# Altium project T20_DevBoard.PrjPcb (part 2 of 4)

## Sheet FTDI_USB.SchDoc: FTDI_USB
size 420 x 297 mm; DrawnBy: Orhun Dabak; Revision: 1.0; SheetNumber: 2; SheetTotal: 7; SPICEModelCacheUDHWENGR: <root> / <DocumentId>UDHWENGR</DocumentId> / <CacheFrame Number="0"> / <Model Name="emk105b7104_v-f" Kind="CKT"> / <Text>* EMK105B7104_V-F     SPICE MODEL  ( General Type ) / *-------------------------------------------------------------------------------------------------------- / * Model Generated by TAIYO YUDEN Corporation (http://www.ty-top.com) / * Version 1.0 / * TAIYO YUDEN Control No. 170508_060911 / * Copyright(c) 2012 TAIYO YUDEN CO.,LTD. All Rights Reserved. / *-------------------------------------------------------------------------------------------------------- / * / * Products Name : Multilayer Ceramic Capacitors / * / * Characteristics : / *     Capacitance : 0.1 uF , Rated Voltage : 16V , TCC : X7R / *     Case Size : 1.0 x 0.5 / 0.039 x 0.02 [mm/inch] , Thickness : 0.5 / 0.02 [mm/inch] / *     (Conditions: Temperature = 25 degC , DC Bias Current/Voltage = 0A / 0V) / * / * Frequency Range : 40Hz - 3GHz / * / * External Node Assignments : / * / *  1  o---| |---o  2 / * / *-------------------------------------------------------------------------------------------------------- / .SubCkt EMK105B7104_V-F 1 2 / **************************** / C0 1 110 0.078576u / Cm 1 101 9325p / C1 101 102 0.029504u / Rc1 101 102 20.922k / C2 102 103 0.015889u / Rc2 102 103 752.47 / C3 103 110 9030.9p / Rc3 103 110 42.225 / C2m 1 301 0.010371u / C21 301 302 0.22482u / Rc21 301 302 25.719k / C22 302 303 0.052111u / Rc22 302 303 73.689k / C23 303 304 0.075487u / Rc23 303 304 43.787k / C24 304 305 0.050427u / Rc24 304 305 2.2584k / C25 305 306 0.042135u / Rc25 305 306 2.2366k / C26 306 307 0.027488u / Rc26 306 307 1.4601k / C27 307 308 8717.3p / Rc27 307 308 231.75 / C28 308 309 8175.5p / Rc28 308 309 113.05 / C29 309 110 178.6p / Rc29 309 110 45.492 / Rp0 1 110 5G / L0 110 120 0.26393n / Lm 120 130 0.11117n / L1 120 121 0.031719n / RL1 121 130 1.0875 / L2 120 122 0.047268n / RL2 122 130 1.8421 / L3 120 123 0.48038n / RL3 123 130 1.1837 / CR 120 124 0.025618u / LR 124 125 0.058788n / RR 125 130 0.11414 / CL 130 140 2.3422p / LL 130 140 0.14249n / RL 130 140 315.53 / Rs 140 2 14.357m / **************************** / .ends EMK105B7104_V-F</Text> / </Model> / </CacheFrame> / </root>
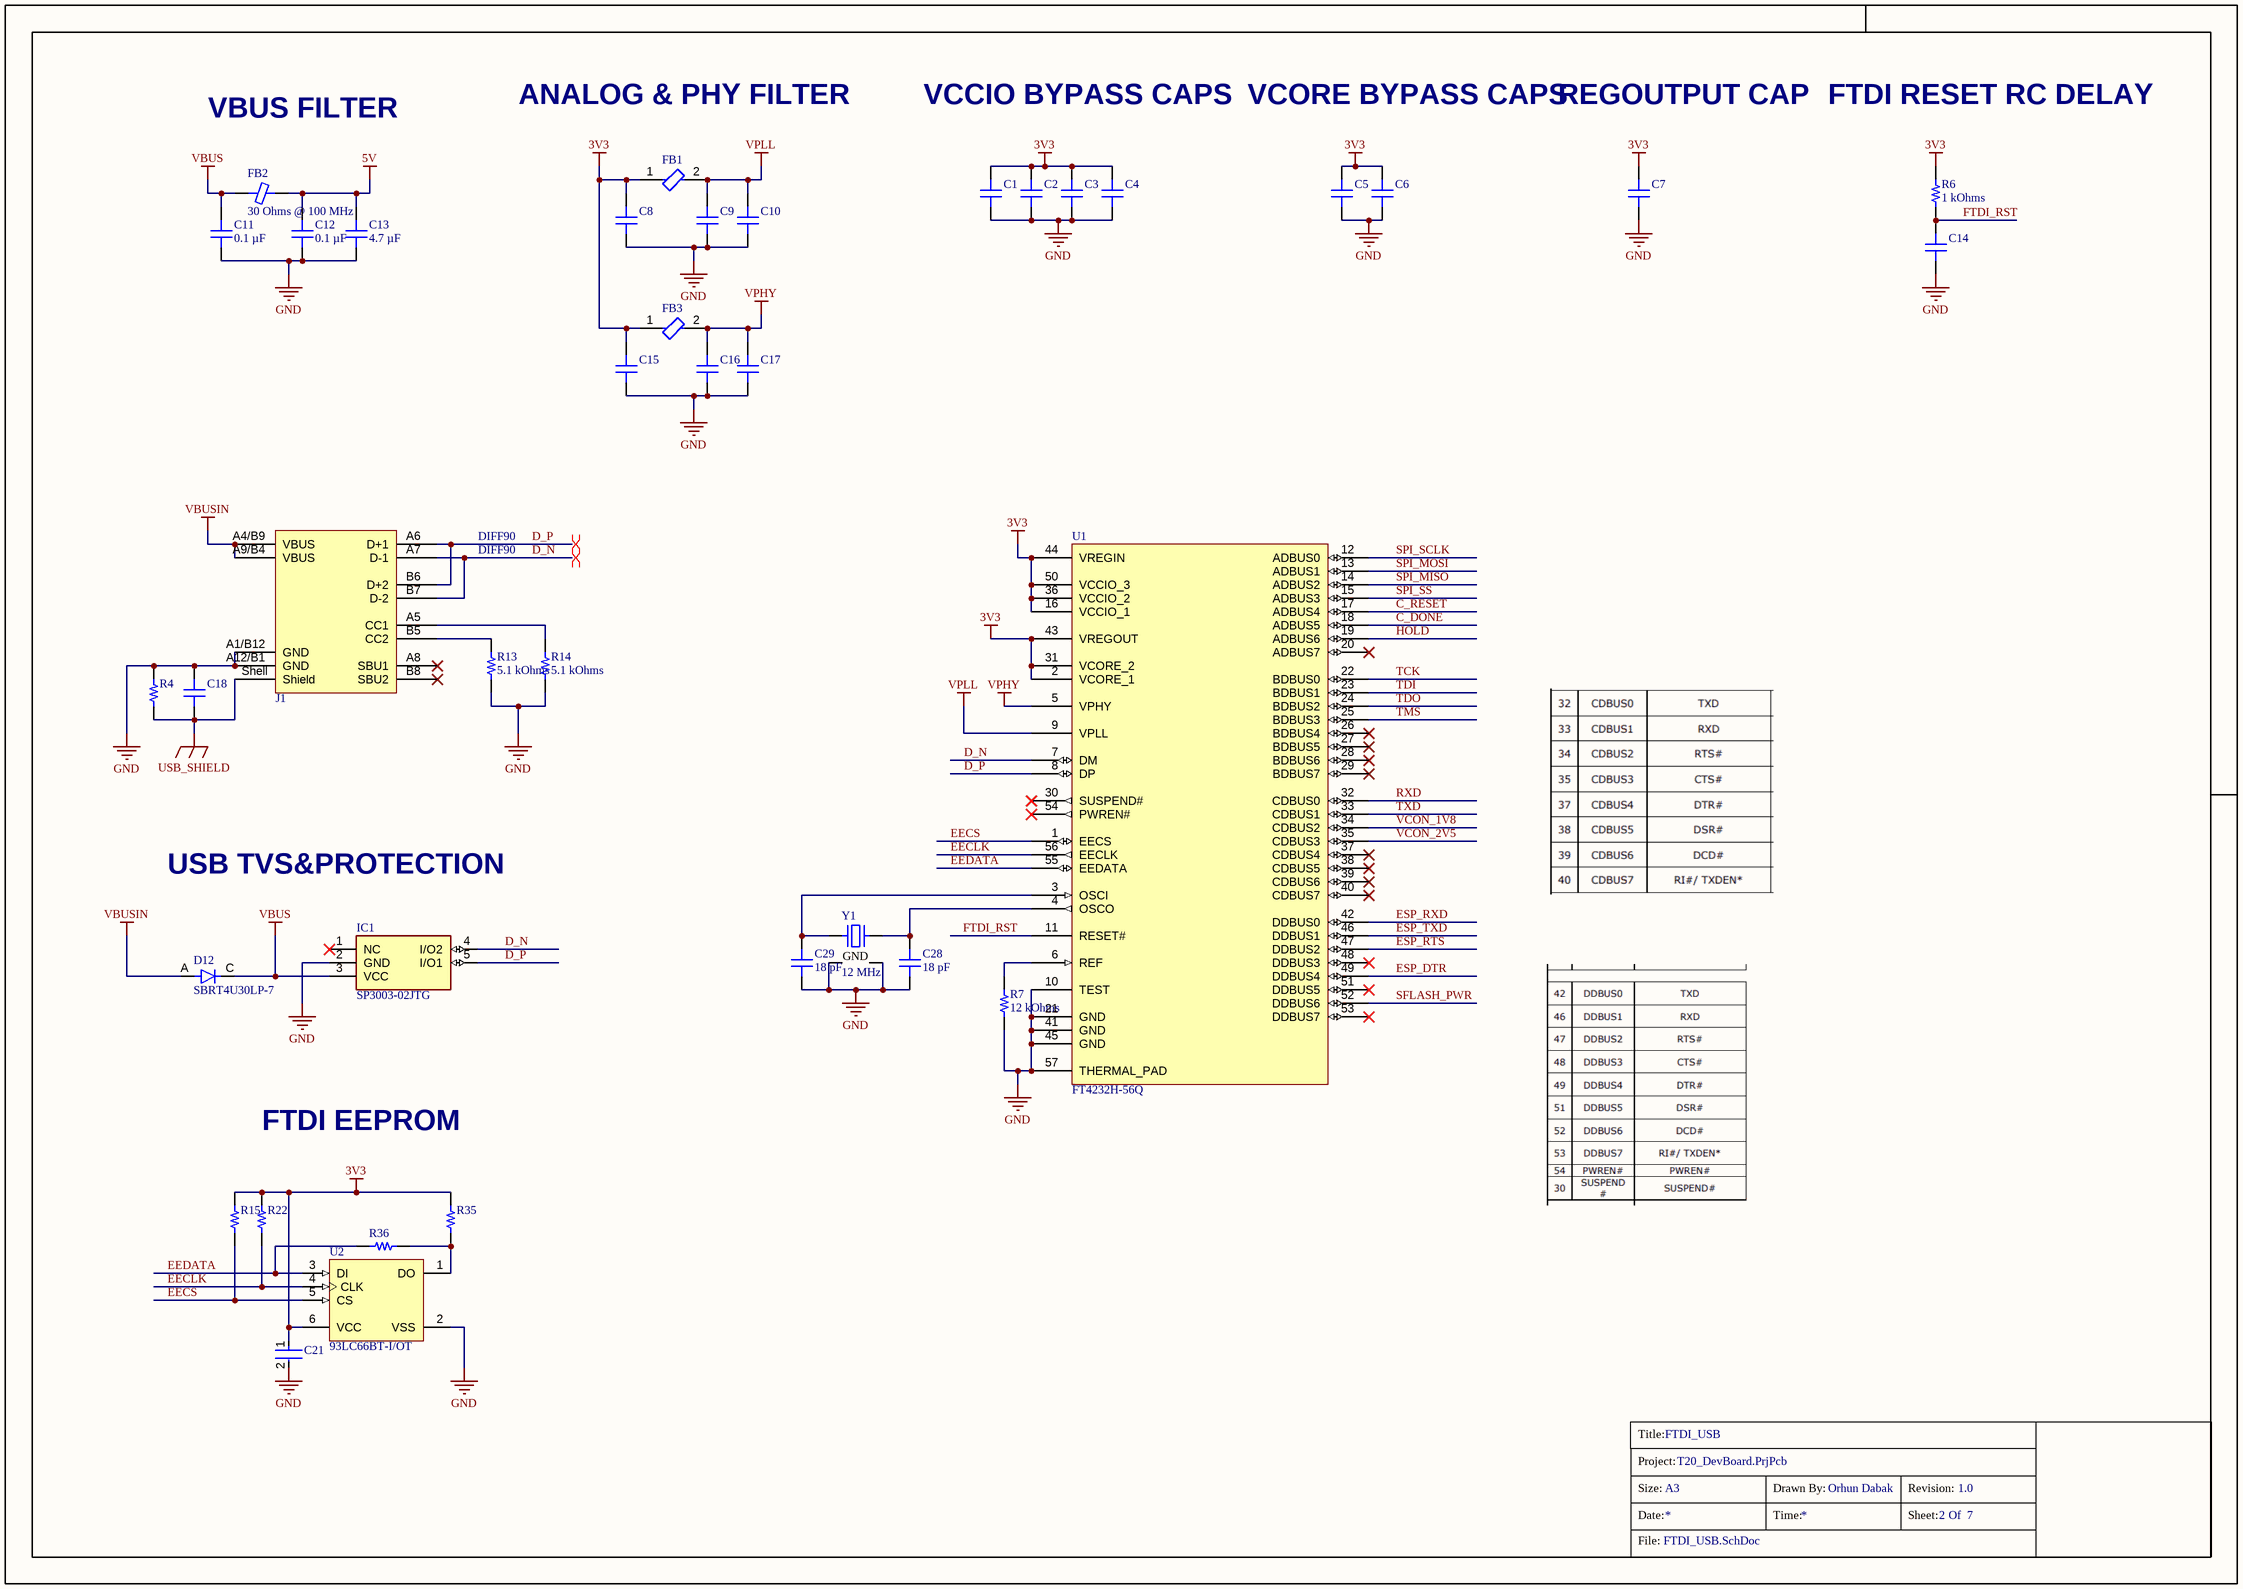
[diagram p1: FTDI_USB.SchDoc]

### Parts
(Parts that share a designator on the sheet are numbered #1, #2 ... from top to bottom, then left to right.)
?#2  (no value)  (graphical)
C1  0.1 µF  [CAP 0402_1005]  (value not drawn)
C2  0.1 µF  [CAP 0402_1005]  (value not drawn)
C3  0.1 µF  [CAP 0402_1005]  (value not drawn)
C4  0.1 µF  [CAP 0402_1005]  (value not drawn)
C5  0.1 µF  [CAP 0402_1005]  (value not drawn)
C6  0.1 µF  [CAP 0402_1005]  (value not drawn)
C7  4.7 µF  [CAP 0402_1005]  (value not drawn)
C8  0.1 µF  [CAP 0402_1005]  (value not drawn)
C9  0.1 µF  [CAP 0402_1005]  (value not drawn)
C10  4.7 µF  [CAP 0402_1005]  (value not drawn)
C11  0.1 µF  [CAP 0603_1608]
C12  0.1 µF  [CAP 0603_1608]
C13  4.7 µF  [CAP 0603_1608]
C14  0.1 µF  [CAP 0402_1005]  (value not drawn)
C15  0.1 µF  [CAP 0402_1005]  (value not drawn)
C16  0.1 µF  [CAP 0402_1005]  (value not drawn)
C17  4.7 µF  [CAP 0402_1005]  (value not drawn)
C18  10000 pF  [CAP 0402_1005]  (value not drawn)
C21  EMK105B7104KV-F  [FP-0402-L_1_0_0_05-W_0_5-MFG]  (value not drawn)
C28  18 pF  [CAP 0402_1005]
C29  18 pF  [CAP 0402_1005]
D12  SBRT4U30LP-7  [DIO_SBRT4U30LP-7]
FB1  BLM15AX601SN1D  [FP-BLM15-0_05-IPC_B]  (value not drawn)
FB2  30 Ohms @ 100 MHz  [FER 0805_2012]
FB3  BLM15AX601SN1D  [FP-BLM15-0_05-IPC_B]  (value not drawn)
IC1  SP3003-02JTG  [SOT65P220X110-5N]
J1  629722000214  [629722000214]  (value not drawn)
R4  1 MOhms  [RES 0402_1005]  (value not drawn)
R6  1 kOhms  [RES 0402_1005]
R7  12 kOhms  [RES 0402_1005]
R13  5.1 kOhms  [RES 0402_1005]
R14  5.1 kOhms  [RES 0402_1005]
R15  10 kOhms  [RES 0402_1005]  (value not drawn)
R22  10 kOhms  [RES 0402_1005]  (value not drawn)
R35  10 kOhms  [RES 0402_1005]  (value not drawn)
R36  2.2 kOhms  [RES 0402_1005]  (value not drawn)
U1  FT4232H-56Q  [QFN50P800X800X100-57N-D]
U2  93LC66BT-I/OT  [SOT-23-OT6_N]
Y1  12 MHz  [NDK NX3225GA]

### Nets
3V3: C1.2 C2.2 C3.2 C4.2 C5.2 C6.2 C7.2 C8.2 C15.2 C21.1 FB1.1 FB3.1 R6.2 R15.2 R22.2 R35.2 U1.2(VCORE_1) U1.16(VCCIO_1) U1.31(VCORE_2) U1.36(VCCIO_2) U1.43(VREGOUT) U1.44(VREGIN) U1.50(VCCIO_3) U2.6(VCC)
5V: C12.2 C13.2 FB2.2
GND: C1.1 C2.1 C3.1 C4.1 C5.1 C6.1 C7.1 C8.1 C9.1 C10.1 C11.1 C12.1 C13.1 C14.1 C15.1 C16.1 C17.1 C18.2 C21.2 C28.1 C29.1 IC1.2(GND) J1.A1/B12(GND) J1.A12/B1(GND) R4.2 R7.1 R13.1 R14.1 U1.10(TEST) U1.21(GND) U1.41(GND) U1.45(GND) U1.57(THERMAL_PAD) U2.2(VSS) Y1.2(GND) Y1.4(GND)
USB_SHIELD: C18.1 J1.Shell(Shield) R4.1
VBUS: C11.2 D12.C(K) FB2.1 IC1.3(VCC)
VBUSIN: D12.A J1.A4/B9(VBUS) J1.A9/B4(VBUS)
VPHY: C16.2 C17.2 FB3.2 U1.5(VPHY)
VPLL: C9.2 C10.2 FB1.2 U1.9(VPLL)
C_DONE: U1.18(ADBUS5)
C_RESET: U1.17(ADBUS4)
D_N: IC1.4(I/O2) J1.A7(D-1) J1.B7(D-2) U1.7(DM)
D_P: IC1.5(I/O1) J1.A6(D+1) J1.B6(D+2) U1.8(DP)
EECLK: R22.1 U1.56(EECLK) U2.4(CLK)
EECS: R15.1 U1.1(EECS) U2.5(CS)
EEDATA: R36.1 U1.55(EEDATA) U2.3(DI)
ESP_DTR: U1.49(DDBUS4)
ESP_RTS: U1.47(DDBUS2)
ESP_RXD: U1.42(DDBUS0)
ESP_TXD: U1.46(DDBUS1)
FTDI_RST: C14.2 R6.1 U1.11(RESET#)
HOLD: U1.19(ADBUS6)
RXD: U1.32(CDBUS0)
SFLASH_PWR: U1.52(DDBUS6)
SPI_MISO: U1.14(ADBUS2)
SPI_MOSI: U1.13(ADBUS1)
SPI_SCLK: U1.12(ADBUS0)
SPI_SS: U1.15(ADBUS3)
TCK: U1.22(BDBUS0)
TDI: U1.23(BDBUS1)
TDO: U1.24(BDBUS2)
TMS: U1.25(BDBUS3)
TXD: U1.33(CDBUS1)
VCON_1V8: U1.34(CDBUS2)
VCON_2V5: U1.35(CDBUS3)
NetC28_2: C28.2 U1.4(OSCO) Y1.3
NetC29_2: C29.2 U1.3(OSCI) Y1.1
NetJ1_A5: J1.A5(CC1) R14.2
NetJ1_B5: J1.B5(CC2) R13.2
NetR7_2: R7.2 U1.6(REF)
NetR35_1: R35.1 R36.2 U2.1(DO)

Not connected (* = marked no-connect by the designer): IC1 1(NC)*; J1 A8(SBU1)* B8(SBU2)*; U1 20(ADBUS7)* 26(BDBUS4)* 27(BDBUS5)* 28(BDBUS6)* 29(BDBUS7)* 30(SUSPEND#)* 37(CDBUS4)* 38(CDBUS5)* 39(CDBUS6)* 40(CDBUS7)* 48(DDBUS3)* 51(DDBUS5)* 53(DDBUS7)* 54(PWREN#)*

### Layout directives
differential pair; differential pair class DIFF90: D_N, D_P

### Notes on the sheet
- VBUS FILTER
- ANALOG & PHY FILTER
- VCCIO BYPASS CAPS
- VCORE BYPASS CAPS
- REGOUTPUT CAP
- FTDI RESET RC DELAY
- USB TVS&PROTECTION
- FTDI EEPROM
- Title:
- Project:
- Size:
- Date:
- File:
- A3
- Time:
- Drawn By:
- Sheet:
- Revision:
- Of

### Library data of the parts
?#2 = Title_Block
C1-C6 C8 C9 C14-C16 = CC0402KRX7R6BB104: CAP CER 0.1UF 10V X7R 0402; manufacturer: Yageo; Tolerance: ±10%; Part Number: CC0402KRX7R6BB104; Value: 0.1 µF; Applications: General Purpose; Capacitance: 0.1 µF; componentlink1description: Datasheet; componentlink1url: https://www.yageo.com/upload/media/product/productsearch/datasheet/mlcc/UPY-GPHC_X7R_6.3V-to-50V_18.pdf; componentlink2description: DigiKey Link; componentlink2url: https://www.digikey.com/en/products/detail/yageo/CC0402KRX7R6BB104/2103083; Device Package: 0402 (1005 Metric); lastupdated: 19/09/2022 12:57:28; Lifecycle Status: Active; Minimum Order: 1; Mounting Type: Surface Mount, MLCC; Operating Temperature: -55°C ~ 125°C; Package / Case: 0402 (1005 Metric); packaging: CutTape; partid: 3877; Part Status: Active; price: 0.01; series: CC; Size / Dimension: 0.039" L x 0.020" W (1.00mm x 0.50mm); Supplier 1: DigiKey; Supplier Part Number 1: 311-1345-1-ND; Temperature Coefficient: X7R; Thickness (Max): 0.022" (0.55mm); Voltage - Rated: 10V
C7 C10 C17 = CL05A475MP5NRNC: CAP CER 4.7UF 10V X5R 0402; manufacturer: Samsung Electro-Mechanics; Tolerance: ±20%; Part Number: CL05A475MP5NRNC; Value: 4.7 µF; Applications: General Purpose; Capacitance: 4.7 µF; componentlink1description: Datasheet; componentlink1url: http://www.samsungsem.com/kr/support/product-search/mlcc/CL05A475MP5NRNC.jsp; componentlink2description: DigiKey Link; componentlink2url: https://www.digikey.com/en/products/detail/samsung-electro-mechanics/CL05A475MP5NRNC/3887140; Device Package: 0402 (1005 Metric); lastupdated: 19/09/2022 12:57:17; Lifecycle Status: Active; Minimum Order: 1; Mounting Type: Surface Mount, MLCC; Operating Temperature: -55°C ~ 85°C; Package / Case: 0402 (1005 Metric); packaging: TapeAndReel; partid: 7650; Part Status: Active; price: 0.01; series: CL; Size / Dimension: 0.039" L x 0.020" W (1.00mm x 0.50mm); Supplier 1: DigiKey; Supplier Part Number 1: 1276-1482-1-ND; Temperature Coefficient: X5R; Thickness (Max): 0.022" (0.55mm); Voltage - Rated: 10V
C11 C12 = C0603X104M3RAC7867: CAP CER 0.1UF 25V X7R 0603; manufacturer: KEMET; Tolerance: ±20%; Part Number: C0603X104M3RAC7867; Value: 0.1 µF; Applications: Boardflex Sensitive; Capacitance: 0.1 µF; componentlink1description: Datasheet; componentlink1url: https://api.kemet.com/component-edge/download/datasheet/C0603X104M3RACTU.pdf; componentlink2description: DigiKey Link; componentlink2url: https://www.digikey.com/en/products/detail/kemet/C0603X104M3RAC7867/2202613; Device Package: 0603 (1608 Metric); Features: Soft Termination; lastupdated: 9/19/2022 01:01:19 PM; Lifecycle Status: Active; Minimum Order: 1; Mounting Type: Surface Mount, MLCC; Operating Temperature: -55°C ~ 125°C; Package / Case: 0603 (1608 Metric); packaging: TapeAndReel; partid: 2484; Part Status: Active; price: 0.07; series: SMD Comm X7R Flex; Size / Dimension: 0.063" L x 0.031" W (1.60mm x 0.80mm); Supplier 1: DigiKey; Supplier Part Number 1: 399-13148-1-ND; Temperature Coefficient: X7R; Thickness (Max): 0.034" (0.87mm); Voltage - Rated: 25V
C13 = CL10A475KA8NQNC: CAP CER 4.7UF 25V X5R 0603; manufacturer: Samsung Electro-Mechanics; Tolerance: ±10%; Part Number: CL10A475KA8NQNC; Value: 4.7 µF; Applications: General Purpose; Capacitance: 4.7 µF; componentlink1description: Datasheet; componentlink1url: http://www.samsungsem.com/kr/support/product-search/mlcc/CL10A475KA8NQNC.jsp; componentlink2description: DigiKey Link; componentlink2url: https://www.digikey.com/en/products/detail/samsung-electro-mechanics/CL10A475KA8NQNC/3887558; Device Package: 0603 (1608 Metric); lastupdated: 1/3/2023 08:07:48 PM; Lifecycle Status: Active; Minimum Order: 1; Mounting Type: Surface Mount, MLCC; Operating Temperature: -55°C ~ 85°C; Package / Case: 0603 (1608 Metric); packaging: TapeAndReel; partid: 2349; Part Status: Active; price: 0.06; series: CL; Size / Dimension: 0.063" L x 0.031" W (1.60mm x 0.80mm); Supplier 1: DigiKey; Supplier Part Number 1: 1276-1900-1-ND; Temperature Coefficient: X5R; Thickness (Max): 0.035" (0.90mm); Voltage - Rated: 25V
C18 = CC0402KRX7R0BB103: CAP CER 10000PF 100V X7R 0402; manufacturer: Yageo; Tolerance: ±10%; Part Number: CC0402KRX7R0BB103; Value: 10000 pF; Applications: General Purpose; Capacitance: 10000 pF; componentlink1description: Datasheet; componentlink1url: https://www.yageo.com/upload/media/product/productsearch/datasheet/mlcc/UPY-NP0X7R_MV_100-to-630V_24.pdf; componentlink2description: DigiKey Link; componentlink2url: https://www.digikey.com/en/products/detail/yageo/CC0402KRX7R0BB103/11489823; Device Package: 0402 (1005 Metric); lastupdated: 19/09/2022 12:56:51; Lifecycle Status: Active; Minimum Order: 1; Mounting Type: Surface Mount, MLCC; Operating Temperature: -55°C ~ 125°C; Package / Case: 0402 (1005 Metric); packaging: TapeAndReel; partid: 33421; Part Status: Active; price: 0.01; series: CC; Size / Dimension: 0.039" L x 0.020" W (1.00mm x 0.50mm); Supplier 1: DigiKey; Supplier Part Number 1: 13-CC0402KRX7R0BB103CT-ND; Temperature Coefficient: X7R; Thickness (Max): 0.022" (0.55mm); Voltage - Rated: 100V
C21 = CMP-14477-000055-2: None; Voltage Rating: 16V; Tolerance: 10%; Dielectric: X7R; Capacitance: 100nF; Width: 0.02inch; RoHS Compliant: Yes; Resistor Type: Ceramic; Radiation Hardening: No; Case Code (Imperial): 0402; Height: 0.5mm; Case Code (Metric): 1005; Halogen Free: Halogen Free; Series: M; Thickness: 0.022inch; Case/Package: 0402; Construction: Flat; Mount: Surface Mount; Voltage Rating (DC): 16V; Depth: 0.5mm; Min Operating Temperature: -55°C; Package Quantity: 1; Packaging: Tape and Reel; Termination: SMD/SMT; Length: 1mm; Max Operating Temperature: 125°C; Lead Free: Lead Free; Number of Pins: 2
C28 C29 = C0402C180J5GACAUTO: CAP CER 18PF 50V C0G/NP0 0402; manufacturer: KEMET; Temperature Coefficient: C0G, NP0; Tolerance: ±5%; Part Number: C0402C180J5GACAUTO; Value: 18 pF; Applications: Automotive; Capacitance: 18 pF; componentlink1description: Datasheet; componentlink1url: https://api.kemet.com/component-edge/download/datasheet/C0402C180J5GACAUTO.pdf; componentlink2description: DigiKey Link; componentlink2url: https://www.digikey.com/en/products/detail/kemet/C0402C180J5GACAUTO/7516186; Device Package: 0402 (1005 Metric); Features: Low ESL; lastupdated: 1/27/2023 08:04:30 PM; Lifecycle Status: Active; Minimum Order: 1; Mounting Type: Surface Mount, MLCC; Operating Temperature: -55°C ~ 125°C; Package / Case: 0402 (1005 Metric); packaging: TapeAndReel; partid: 1878; Part Status: Active; price: 0.01; Ratings: AEC-Q200; series: SMD Auto C0G; Size / Dimension: 0.039" L x 0.020" W (1.00mm x 0.50mm); Supplier 1: DigiKey; Supplier Part Number 1: 399-15952-1-ND; Thickness (Max): 0.022" (0.55mm); Voltage - Rated: 50V
D12 = SBRT4U30LP-7: Diode Super Barrier 30 V 4A Surface Mount U-DFN2020-2; MF: Diodes Inc.; Purchase-URL: https://pricing.snapeda.com/search/part/SBRT4U30LP-7/?ref=eda; Price: None; Value: *; Check_prices: https://www.snapeda.com/parts/SBRT4U30LP-7/Diodes+Inc./view-part/?ref=eda; SnapEDA_Link: https://www.snapeda.com/parts/SBRT4U30LP-7/Diodes+Inc./view-part/?ref=snap; Package: UFDFN-2 Diodes Inc.; Availability: In Stock; MP: SBRT4U30LP-7
FB1 FB3 = CMP-0686-00246-4: Chip Ferrite Bead, 0402, 600Ω @ 100MHz, 0.34Ω, 25%, 500mA; Material: Steel; DC Resistance (DCR): 340mR; Impedance: 600R; Number of Circuits: 1; Max Current Rating: 500mA; Core Material: Ferrite; Lead Free: Lead Free; Series: BLM15AX_SN; Number of Pins: 2; Package Quantity: 1; Length: 1mm; Height: 0.5mm; Width: 0.5mm; Packaging: Tape and Reel; RoHS Compliant: Yes; Test Frequency: 100MHz; Case Code (Imperial): 0402; Depth: 0.5mm; Case/Package: 0402; Min Operating Temperature: -55°C; Max Operating Temperature: 125°C; Max DC Current: 500mA; Current Rating: 500mA; REACH SVHC: No SVHC; Termination: SMD/SMT; Tolerance: 25%; Case Code (Metric): 1005; Number of Lines: 1; DC Resistance-Max: 340mR
FB2 = BLM21PG300SN1D: FERRITE BEAD 30 OHM 0805 1LN; Manufacturer: Murata Electronics; Current Rating (Max): 4A; DC Resistance (DCR) (Max): 14mOhm; Filter Type: Power Line; Number of Lines: 1; Part Number: BLM21PG300SN1D; ComponentLink1Description: Datasheet; ComponentLink1URL: https://www.murata.com/en-us/products/en-us/products/productdata/8796738977822/ENFA0005.pdf; ComponentLink2Description: DigiKey Link; ComponentLink2URL: https://www.digikey.com/en/products/detail/murata-electronics/BLM21PG300SN1D/584262; Device Package: 0805 (2012 Metric); Height (Max): 0.041" (1.05mm); Impedance @ Frequency: 30 Ohms @ 100 MHz; LastUpdated: 1/2/2023 08:51:58 PM; Lifecycle Status: Active; Minimum Order: 1; Mounting Type: Surface Mount; Operating Temperature: -55°C ~ 125°C; Package / Case: 0805 (2012 Metric); Packaging: TapeAndReel; PartId: 1376; Part Status: Active; Price: 0.02; Series: EMIFIL®, BLM21; Size / Dimension: 0.079" L x 0.049" W (2.00mm x 1.25mm); Supplier 1: DigiKey; Supplier Part Number 1: 490-1052-1-ND; Value: 30 Ohms @ 100 MHz
IC1 = SP3003-02JTG: Integrated Circuit; Manufacturer_Name: LITTELFUSE; Datasheet Link: https://datasheet.datasheetarchive.com/originals/distributors/Datasheets-DGA26/1840396.pdf; Height: 1.1mm; Manufacturer_Part_Number: SP3003-02JTG; Mouser Part Number: 576-SP3003-02JTG; Mouser Price/Stock: https://www.mouser.co.uk/ProductDetail/Littelfuse/SP3003-02JTG?qs=je4hkJKt%2FJ1VE%2FhJSW73jg%3D%3D; Arrow Part Number: SP3003-02JTG; Arrow Price/Stock: https://www.arrow.com/en/products/sp3003-02jtg/littelfuse?region=nac
J1 = 629722000214: WR-USB 2.0 Type C, Receptacle, Horizontal, SMT; Manufacturer: Wurth Elektronik; Interface Type: Type C; Number of Ports: 1; Rated Current: 5A; Working Voltage: 20VAC; ComponentLink1Description: Website Link; ComponentLink1URL: https://www.we-online.com/redexpert/article/629722000214?ad; ComponentLink2Description: Datasheet Link; ComponentLink2URL: https://www.we-online.com/redexpert/spec/629722000214?ad; Manufacturer Part Number: 629722000214; Category: Input/Output Connectors; Match Code: WR-USB; Mount: Surface Mount; Operating Temperature Max: 85°C; Operating Temperature Min: -40°C; Packaging: Tape and Reel; Application: USB 2.0; Gender: Receptacle; Number of Pins: 16; Orientation: Horizontal
R4 = AC0402FR-071ML: RES SMD 1M OHM 1% 1/16W 0402; Manufacturer: Yageo; Power (Watts): 0.063W, 1/16W; Temperature Coefficient: ±100ppm/°C; Part Number: AC0402FR-071ML; Value: 1 MOhms; ComponentLink1Description: Datasheet; ComponentLink1URL: https://www.yageo.com/upload/media/product/productsearch/datasheet/rchip/PYu-AC_51_RoHS_L_7.pdf; ComponentLink2Description: DigiKey Link; ComponentLink2URL: https://www.digikey.com/en/products/detail/yageo/AC0402FR-071ML/5895164; Composition: Thick Film; Device Package: 0402 (1005 Metric); Features: Automotive AEC-Q200, Moisture Resistant; Height - Seated (Max): 0.015" (0.37mm); LastUpdated: 19/09/2022 13:14:31; Lifecycle Status: Active; Minimum Order: 1; Number of Terminations: 2; Operating Temperature: -55°C ~ 155°C; Package / Case: 0402 (1005 Metric); Packaging: CutTape; PartId: 12043; Part Status: Active; Price: 0.01; Ratings: AEC-Q200; Resistance: 1 MOhms; Series: AC; Size / Dimension: 0.039" L x 0.020" W (1.00mm x 0.50mm); Supplier 1: DigiKey; Supplier Part Number 1: YAG3450CT-ND; Supplier Device Package: 0402; Tolerance: ±1%
R6 = RC0402JR-071KP: RES SMD 1K OHM 5% 1/16W 0402; Manufacturer: Yageo; Power (Watts): 0.063W, 1/16W; Temperature Coefficient: ±150ppm/°C; Part Number: RC0402JR-071KP; Value: 1 kOhms; ComponentLink1Description: Datasheet; ComponentLink1URL: http://www.yageo.com/NewPortal/yageodocoutput?fileName=/pdf/R-Chip/PYu-RC_51_RoHS_P_0.pdf; ComponentLink2Description: DigiKey Link; ComponentLink2URL: https://www.digikey.com/en/products/detail/yageo/RC0402JR-071KP/4935299; Composition: Thick Film; Device Package: 0402 (1005 Metric); Features: Moisture Resistant; Height - Seated (Max): 0.016" (0.40mm); LastUpdated: 1/2/2023 08:21:40 PM; Lifecycle Status: Active; Minimum Order: 1; Number of Terminations: 2; Operating Temperature: -55°C ~ 155°C; Package / Case: 0402 (1005 Metric); Packaging: CutTape; PartId: 5283; Part Status: Active; Price: 0.01; Resistance: 1 kOhms; Series: RC-P Lead Free; Size / Dimension: 0.039" L x 0.020" W (1.00mm x 0.50mm); Supplier 1: DigiKey; Supplier Part Number 1: YAG1284CT-ND; Supplier Device Package: 0402; Tolerance: ±5%
R7 = CPF0402B12KE1: RES SMD 12K OHM 0.1% 1/16W 0402; Manufacturer: TE Connectivity Passive Product; Power (Watts): 0.063W, 1/16W; Temperature Coefficient: ±25ppm/°C; Part Number: CPF0402B12KE1; Value: 12 kOhms; ComponentLink1Description: Datasheet; ComponentLink1URL: https://www.te.com/commerce/DocumentDelivery/DDEController?Action=srchrtrv&DocNm=1773200&DocType=DS&DocLang=English; ComponentLink2Description: DigiKey Link; ComponentLink2URL: https://www.digikey.com/en/products/detail/te-connectivity-passive-product/CPF0402B12KE1/2381830; Composition: Thin Film; Device Package: 0402 (1005 Metric); Height - Seated (Max): 0.014" (0.35mm); LastUpdated: 1/2/2023 08:21:48 PM; Lifecycle Status: Active; Minimum Order: 1; Number of Terminations: 2; Operating Temperature: -55°C ~ 155°C; Package / Case: 0402 (1005 Metric); Packaging: TapeAndReel; PartId: 3318; Part Status: Active; Price: 0.13; Resistance: 12 kOhms; Series: CPF, Neohm; Size / Dimension: 0.039" L x 0.020" W (1.00mm x 0.50mm); Supplier 1: DigiKey; Supplier Part Number 1: A102603CT-ND; Supplier Device Package: 0402; Tolerance: ±0.1%
R13 R14 = AC0402JR-075K1L: RES SMD 5.1K OHM 5% 1/16W 0402; Manufacturer: Yageo; Power (Watts): 0.063W, 1/16W; Temperature Coefficient: ±100ppm/°C; Part Number: AC0402JR-075K1L; Value: 5.1 kOhms; ComponentLink1Description: Datasheet; ComponentLink1URL: https://www.yageo.com/upload/media/product/productsearch/datasheet/rchip/PYu-AC_51_RoHS_L_7.pdf; ComponentLink2Description: DigiKey Link; ComponentLink2URL: https://www.digikey.com/en/products/detail/yageo/AC0402JR-075K1L/5895695; Composition: Thick Film; Device Package: 0402 (1005 Metric); Features: Automotive AEC-Q200, Moisture Resistant; Height - Seated (Max): 0.015" (0.37mm); LastUpdated: 1/2/2023 08:21:43 PM; Lifecycle Status: Active; Minimum Order: 1; Number of Terminations: 2; Operating Temperature: -55°C ~ 155°C; Package / Case: 0402 (1005 Metric); Packaging: CutTape; PartId: 4690; Part Status: Active; Price: 0.01; Ratings: AEC-Q200; Resistance: 5.1 kOhms; Series: AC; Size / Dimension: 0.039" L x 0.020" W (1.00mm x 0.50mm); Supplier 1: DigiKey; Supplier Part Number 1: YAG3554CT-ND; Supplier Device Package: 0402; Tolerance: ±5%
R15 R22 R35 = RP73PF1E10KBTD: RES 10K OHM 0.1% 1/10W 0402; Manufacturer: TE Connectivity Passive Product; Power (Watts): 0.1W, 1/10W; Temperature Coefficient: ±25ppm/°C; Part Number: RP73PF1E10KBTD; Value: 10 kOhms; ComponentLink1Description: Datasheet; ComponentLink1URL: https://www.te.com/commerce/DocumentDelivery/DDEController?Action=srchrtrv&DocNm=1773272&DocType=DS&DocLang=English; ComponentLink2Description: DigiKey Link; ComponentLink2URL: https://www.digikey.com/en/products/detail/te-connectivity-passive-product/RP73PF1E10KBTD/8260957; Composition: Thin Film; Device Package: 0402 (1005 Metric); Height - Seated (Max): 0.014" (0.35mm); LastUpdated: 9/19/2022 01:15:04 PM; Lifecycle Status: Active; Minimum Order: 1; Number of Terminations: 2; Operating Temperature: -55°C ~ 155°C; Package / Case: 0402 (1005 Metric); Packaging: TapeAndReel; PartId: 2434; Part Status: Active; Price: 0.09; Resistance: 10 kOhms; Series: RP73, Holsworthy; Size / Dimension: 0.039" L x 0.020" W (1.00mm x 0.50mm); Supplier 1: DigiKey; Supplier Part Number 1: A127415CT-ND; Supplier Device Package: 0402; Tolerance: ±0.1%
R36 = TNPW04022K20BYEP: RES 2.2K OHM 0.1% 1/10W 0402; Manufacturer: Vishay Dale; Power (Watts): 0.1W, 1/10W; Temperature Coefficient: ±10ppm/°C; Part Number: TNPW04022K20BYEP; Value: 2.2 kOhms; ComponentLink1Description: Datasheet; ComponentLink1URL: http://www.vishay.com/docs/28758/tnpw_e3.pdf; ComponentLink2Description: DigiKey Link; ComponentLink2URL: https://www.digikey.com/en/products/detail/vishay-dale/TNPW04022K20BYEP/8636618; Composition: Thin Film; Device Package: 0402 (1005 Metric); Features: Anti-Sulfur, Automotive AEC-Q200, Moisture Resistant; Height - Seated (Max): 0.016" (0.40mm); LastUpdated: 1/2/2023 08:21:49 PM; Lifecycle Status: Active; Minimum Order: 1; Number of Terminations: 2; Operating Temperature: -55°C ~ 155°C; Package / Case: 0402 (1005 Metric); Packaging: TapeAndReel; PartId: 3077; Part Status: Active; Price: 0.28; Ratings: AEC-Q200; Resistance: 2.2 kOhms; Series: TNPW e3; Size / Dimension: 0.039" L x 0.020" W (1.00mm x 0.50mm); Supplier 1: DigiKey; Supplier Part Number 1: 541-9805-1-ND; Supplier Device Package: 0402; Tolerance: ±0.1%
U1 = FT4232H-56Q: USB Bridge, USB to UART,FIFO USB 2.0 FIFO Interface 56-VQFN (8x8); Manufacturer: FTDI, Future Technology Devices International Ltd; Manufacturer Product Number: FT4232H-56Q-REEL; Standards: USB 2.0; Voltage - Supply: 3.3V; Supplier 1: Digi-Key; Supplier Part Number 1: 768-1378-1-ND; Supplier 2: Digi-Key; Supplier Part Number 2: 768-1378-6-ND; Supplier 3: RSComponents; Supplier Part Number 3: 1115836; Series: -; Protocol: USB; Function: Bridge, USB to UART,FIFO; Interface: FIFO; Current - Supply: -; ComponentLink1Description: Datasheet; ComponentLink1URL: https://www.ftdichip.com/Support/Documents/DataSheets/ICs/DS_FT4232H.pdf; ComponentLink2Description: Digi-Key Link; ComponentLink2URL: https://www.digikey.com/en/products/detail/ftdi-future-technology-devices-international-ltd/FT4232H-56Q-REEL/5994692; Operating Temperature: -40°C ~ 85°C; Package / Case: 56-VFQFN Exposed Pad; Supplier Device Package: 56-VQFN (8x8)
U2 = CMP-019-00051-3: Microwire Serial EEPROM Family, 2.5Vto 5.5V' 2 MHz, -40°Cto 125°C, SOT-23-6, RoHS
Y1 = NX3225GA-12MHZ-STD-CRG-2: CRYSTAL 12.0000MHZ 8PF SMD; Manufacturer: NDK America, Inc.; ESR (Equivalent Series Resistance): 100 Ohms; Frequency Stability: ±30ppm; Frequency Tolerance: ±20ppm; Operating Mode: Fundamental; Part Number: NX3225GA-12MHZ-STD-CRG-2; ComponentLink1Description: Datasheet; ComponentLink1URL: http://www.ndk.com/images/products/catalog/c_NX3225GA-STD-CRG-2_e.pdf; ComponentLink2Description: DigiKey Link; ComponentLink2URL: https://www.digikey.com/en/products/detail/ndk-america-inc/NX3225GA-12MHZ-STD-CRG-2/3125632; Frequency: 12 MHz; Height - Seated (Max): 0.035" (0.90mm); LastUpdated: 19/09/2022 13:51:54; Lifecycle Status: Active; Load Capacitance: 8pF; Minimum Order: 1; Mounting Type: Surface Mount; Operating Temperature: -40°C ~ 85°C; Package / Case: 4-SMD, No Lead; Packaging: TapeAndReel; PartId: 551; Part Status: Active; Price: 0.33; Series: NX3225GA; Size / Dimension: 0.126" L x 0.098" W (3.20mm x 2.50mm); Supplier 1: DigiKey; Supplier Part Number 1: 644-1173-1-ND; Type: MHz Crystal; Value: 12 MHz

## Sheet USB_OTG.SchDoc: USB_OTG
size 420 x 297 mm; DrawnBy: Orhun Dabak; Revision: 1.0; SheetNumber: 3; SheetTotal: 7; SPICEModelCacheBLVHRVRQ: <root> / <DocumentId>BLVHRVRQ</DocumentId> / </root>
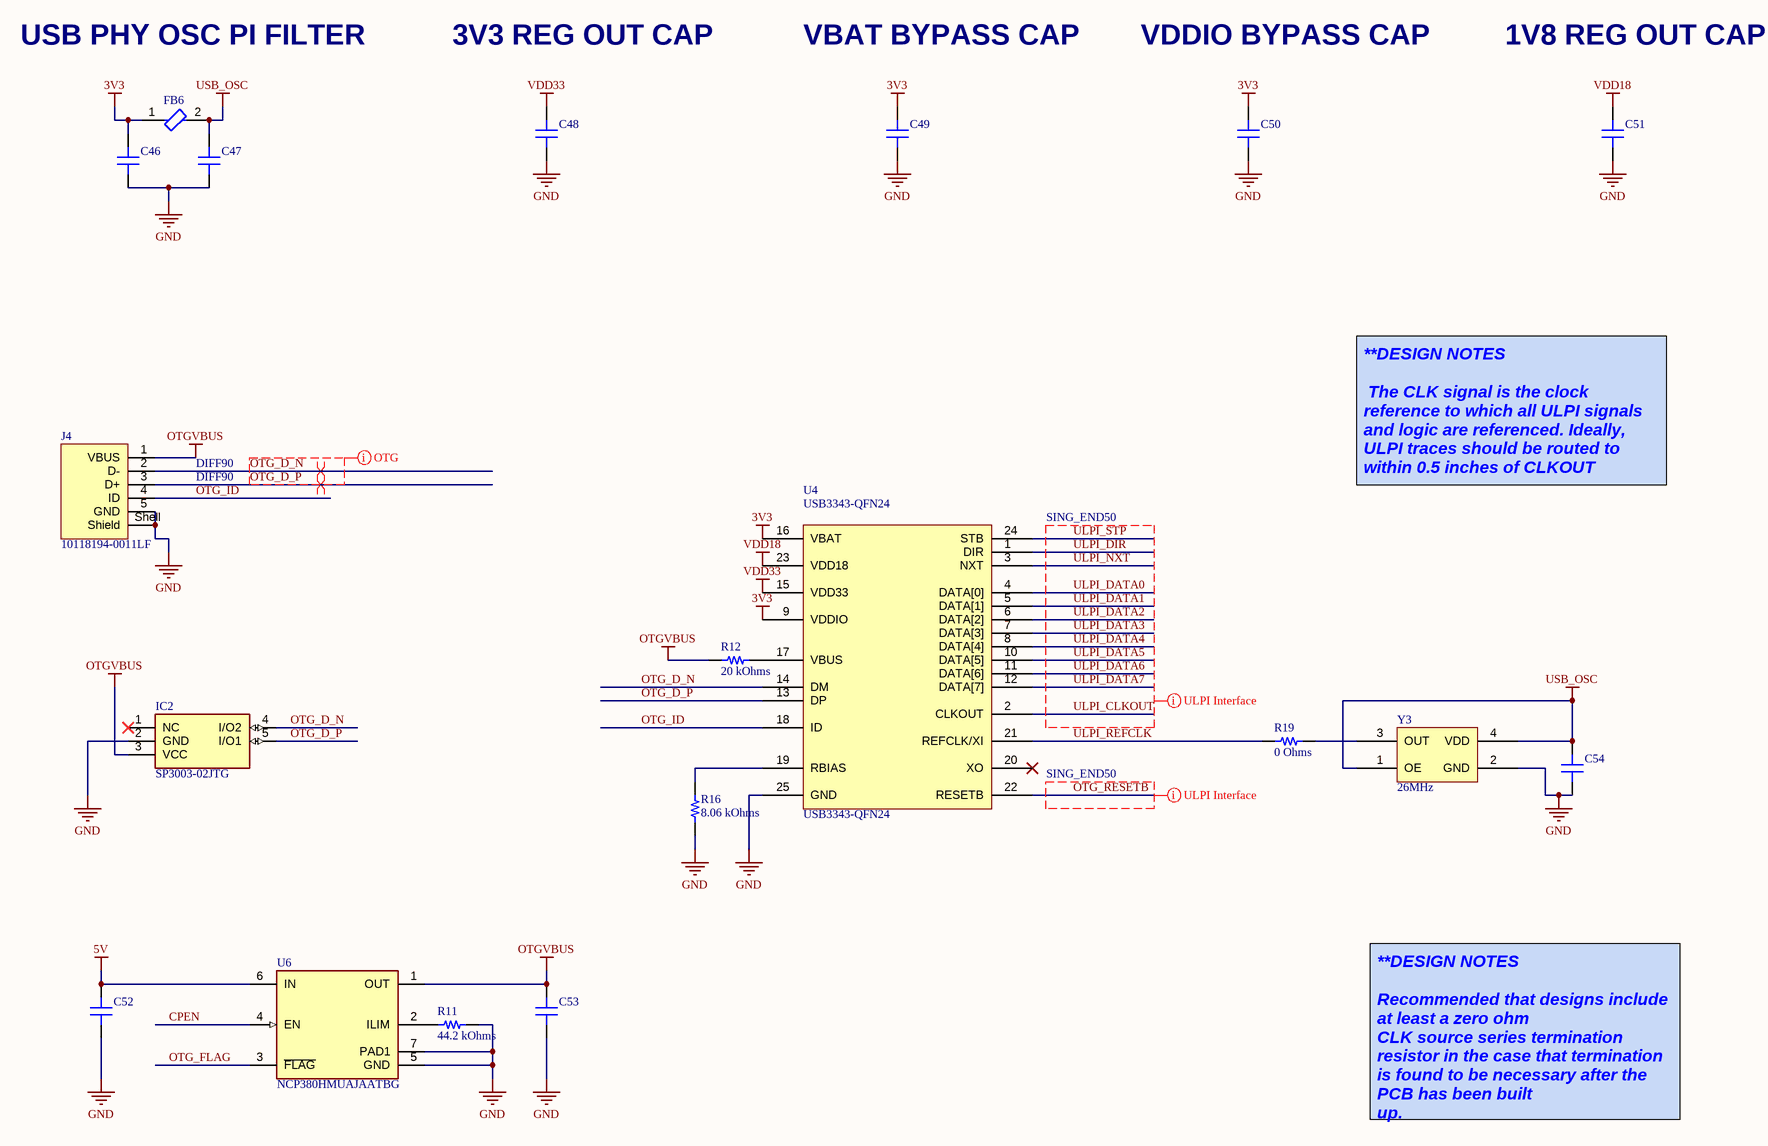
[diagram p2: USB_OTG.SchDoc]

### Parts
(Parts that share a designator on the sheet are numbered #1, #2 ... from top to bottom, then left to right.)
?#3  (no value)  (graphical)
C46  4.7 µF  [CAP 0402_1005]  (value not drawn)
C47  4.7 µF  [CAP 0402_1005]  (value not drawn)
C48  4.7µF  [CAP 0402_1005]  (value not drawn)
C49  0.1 µF  [CAP 0402_1005]  (value not drawn)
C50  0.1 µF  [CAP 0402_1005]  (value not drawn)
C51  4.7µF  [CAP 0402_1005]  (value not drawn)
C52  10 µF  [CAP 0402_1005]  (value not drawn)
C53  4.7 µF  [CAP 1210_3225 - 1MM]  (value not drawn)
C54  10000 pF  [CAP 0402_1005]  (value not drawn)
FB6  BLM15AX601SN1D  [FP-BLM15-0_05-IPC_B]  (value not drawn)
IC2  SP3003-02JTG  [SOT65P220X110-5N]
J4  10118194-0011LF  [10118194-0011LF]
R11  44.2 kOhms  [RES 0402_1005]
R12  20 kOhms  [RES 0402_1005]
R16  8.06 kOhms  [RES 0402_1005]
R19  0 Ohms  [RES 0402_1005]
U4  USB3343-QFN24  [QFN50P400X400X85_HS-25N]
U6  NCP380HMUAJAATBG  [FP-517AB-MFG]
Y3  26MHz  [ABRACON ASVTX-11]

### Nets
3V3: C46.2 C49.2 C50.2 FB6.1 U4.9(VDDIO) U4.16(VBAT)
5V: C52.2 U6.6(IN)
GND: C46.1 C47.1 C48.1 C49.1 C50.1 C51.1 C52.1 C53.1 C54.1 IC2.2(GND) J4.5(GND) J4.Shell(Shield) R11.2 R16.2 U4.25(GND) U6.5(GND) U6.7(PAD1) Y3.2(GND)
OTGVBUS: C53.2 IC2.3(VCC) J4.1(VBUS) R12.1 U6.1(OUT)
USB_OSC: C47.2 C54.2 FB6.2 Y3.1(OE) Y3.4(VDD)
VDD18: C51.2 U4.23(VDD18)
VDD33: C48.2 U4.15(VDD33)
CPEN: U6.4(EN)
OTG_D_N: IC2.4(I/O2) J4.2(D-) U4.14(DM)
OTG_D_P: IC2.5(I/O1) J4.3(D+) U4.13(DP)
OTG_FLAG: U6.3(~{FLAG})
OTG_ID: J4.4(ID) U4.18(ID)
OTG_RESETB: U4.22(RESETB)
ULPI_CLKOUT: U4.2(CLKOUT)
ULPI_DATA0: U4.4(DATA[0])
ULPI_DATA1: U4.5(DATA[1])
ULPI_DATA2: U4.6(DATA[2])
ULPI_DATA3: U4.7(DATA[3])
ULPI_DATA4: U4.8(DATA[4])
ULPI_DATA5: U4.10(DATA[5])
ULPI_DATA6: U4.11(DATA[6])
ULPI_DATA7: U4.12(DATA[7])
ULPI_DIR: U4.1(DIR)
ULPI_NXT: U4.3(NXT)
ULPI_REFCLK: R19.1 U4.21(REFCLK/XI)
ULPI_STP: U4.24(STB)
NetR11_1: R11.1 U6.2(ILIM)
NetR12_2: R12.2 U4.17(VBUS)
NetR16_1: R16.1 U4.19(RBIAS)
NetR19_2: R19.2 Y3.3(OUT)

Not connected (* = marked no-connect by the designer): IC2 1(NC)*; U4 20(XO)*

### Layout directives
net class SING_END50; net class ULPI: OTG_RESETB, ULPI_CLKOUT, ULPI_DATA0, ULPI_DATA1, ULPI_DATA2, ULPI_DATA3, ULPI_DATA4, ULPI_DATA5, ULPI_DATA6, ULPI_DATA7, ULPI_DIR, ULPI_NXT, ULPI_STP
differential pair; differential pair class DIFF90: OTG_D_N, OTG_D_P
net class *OTG: OTG_D_N, OTG_D_P

### Notes on the sheet
- USB PHY OSC PI FILTER
- 3V3 REG OUT CAP
- VBAT BYPASS CAP
- VDDIO BYPASS CAP
- 1V8 REG OUT CAP
- **DESIGN NOTES
  The CLK signal is the clock reference to which all ULPI signals and logic are referenced. Ideally, ULPI traces should be routed to within 0.5 inches of CLKOUT
- **DESIGN NOTES
  Recommended that designs include at least a zero ohm
  CLK source series termination resistor in the case that termination is found to be necessary after the PCB has been built
  up.
- Title:
- Project:
- Size:
- Date:
- File:
- A3
- Time:
- Drawn By:
- Sheet:
- Revision:
- Of

### Library data of the parts
?#3 = Title_Block
C46 C47 = CL05A475MP5NRNC: as C7 on sheet FTDI_USB; Part Number: CL05A475MP5NRNC; Value: 4.7 µF; Applications: General Purpose; Capacitance: 4.7 µF; componentlink1description: Datasheet; componentlink1url: http://www.samsungsem.com/kr/support/product-search/mlcc/CL05A475MP5NRNC.jsp; componentlink2description: DigiKey Link; componentlink2url: https://www.digikey.com/en/products/detail/samsung-electro-mechanics/CL05A475MP5NRNC/3887140; Device Package: 0402 (1005 Metric); lastupdated: 19/09/2022 12:57:17; Lifecycle Status: Active; Minimum Order: 1; Mounting Type: Surface Mount, MLCC; Operating Temperature: -55°C ~ 85°C; Package / Case: 0402 (1005 Metric); packaging: TapeAndReel; partid: 7650; Part Status: Active; price: 0.01; series: CL; Size / Dimension: 0.039" L x 0.020" W (1.00mm x 0.50mm); Supplier 1: DigiKey; Supplier Part Number 1: 1276-1482-1-ND; Temperature Coefficient: X5R; Thickness (Max): 0.022" (0.55mm); Voltage - Rated: 10V
C48 C51 = 0402YD475MAT2A: CAP CER 4.7UF 16V X5R 0402; manufacturer: AVX Corporation; Tolerance: ±20%; Part Number: 0402YD475MAT2A; Value: 4.7µF; Applications: General Purpose; Capacitance: 4.7µF; componentlink1description: Datasheet; componentlink1url: http://datasheets.avx.com/cx5r.pdf; componentlink2description: DigiKey Link; componentlink2url: http://digikey.com/product-detail/en/avx-corporation/0402YD475MAT2A/478-10788-1-ND/7536324; Device Package: 0402 (1005 Metric); lastupdated: 08/02/2022 12:26:39; Lifecycle Status: Active; Minimum Order: 1; Mounting Type: Surface Mount, MLCC; Operating Temperature: -55°C ~ 85°C; Package / Case: 0402 (1005 Metric); packaging: TapeAndReel; partid: 12460; Part Status: Active; price: 0.06; series: -; Size / Dimension: 0.039" L x 0.020" W (1.00mm x 0.50mm); Supplier 1: DigiKey; Supplier Part Number 1: 478-10788-1-ND; Temperature Coefficient: X5R; Thickness (Max): 0.028" (0.71mm); Voltage - Rated: 16V
C49 C50 = CC0402KRX7R6BB104: as C1 on sheet FTDI_USB; Part Number: CC0402KRX7R6BB104; Value: 0.1 µF; Applications: General Purpose; Capacitance: 0.1 µF; componentlink1description: Datasheet; componentlink1url: https://www.yageo.com/upload/media/product/productsearch/datasheet/mlcc/UPY-GPHC_X7R_6.3V-to-50V_18.pdf; componentlink2description: DigiKey Link; componentlink2url: https://www.digikey.com/en/products/detail/yageo/CC0402KRX7R6BB104/2103083; Device Package: 0402 (1005 Metric); lastupdated: 19/09/2022 12:57:28; Lifecycle Status: Active; Minimum Order: 1; Mounting Type: Surface Mount, MLCC; Operating Temperature: -55°C ~ 125°C; Package / Case: 0402 (1005 Metric); packaging: CutTape; partid: 3877; Part Status: Active; price: 0.01; series: CC; Size / Dimension: 0.039" L x 0.020" W (1.00mm x 0.50mm); Supplier 1: DigiKey; Supplier Part Number 1: 311-1345-1-ND; Temperature Coefficient: X7R; Thickness (Max): 0.022" (0.55mm); Voltage - Rated: 10V
C52 = CL05A106MP8NUB8: CAP CER 10UF 10V X5R 0402; manufacturer: Samsung Electro-Mechanics; Tolerance: ±20%; Part Number: CL05A106MP8NUB8; Value: 10 µF; Applications: General Purpose; Capacitance: 10 µF; componentlink1description: Datasheet; componentlink1url: http://www.samsungsem.com/kr/support/product-search/mlcc/CL05A106MP8NUB8.jsp; componentlink2description: DigiKey Link; componentlink2url: https://www.digikey.com/en/products/detail/samsung-electro-mechanics/CL05A106MP8NUB8/5961314; Device Package: 0402 (1005 Metric); lastupdated: 19/09/2022 12:57:36; Lifecycle Status: Active; Minimum Order: 1; Mounting Type: Surface Mount, MLCC; Operating Temperature: -55°C ~ 85°C; Package / Case: 0402 (1005 Metric); packaging: TapeAndReel; partid: 1758; Part Status: Active; price: 0.06; series: CL; Size / Dimension: 0.039" L x 0.020" W (1.00mm x 0.50mm); Supplier 1: DigiKey; Supplier Part Number 1: 1276-6830-1-ND; Temperature Coefficient: X5R; Thickness (Max): 0.035" (0.90mm); Voltage - Rated: 10V
C53 = GMK325BJ475MN-T: CAP CER 4.7UF 35V X5R 1210; manufacturer: Taiyo Yuden; Tolerance: ±20%; Part Number: GMK325BJ475MN-T; Value: 4.7 µF; Applications: SMPS Filtering; Capacitance: 4.7 µF; componentlink1description: Datasheet; componentlink1url: https://www.yuden.co.jp/productdata/catalog/mlcc01_e.pdf; componentlink2description: DigiKey Link; componentlink2url: https://www.digikey.com/en/products/detail/taiyo-yuden/GMK325BJ475MN-T/1212781; Device Package: 1210 (3225 Metric); lastupdated: 19/09/2022 13:23:33; Lifecycle Status: Active; Minimum Order: 1; Mounting Type: Surface Mount, MLCC; Operating Temperature: -55°C ~ 85°C; Package / Case: 1210 (3225 Metric); packaging: TapeAndReel; partid: 24444; Part Status: Active; price: 0.11; series: M; Size / Dimension: 0.126" L x 0.098" W (3.20mm x 2.50mm); Supplier 1: DigiKey; Supplier Part Number 1: 587-1781-1-ND; Temperature Coefficient: X5R; Thickness (Max): 0.083" (2.10mm); Voltage - Rated: 35V
C54 = C0402C103K5RECAUTO: CAP CER 0402 10NF 50V X7R 10%; manufacturer: KEMET; Part Number: C0402C103K5RECAUTO; Value: 10000 pF; Applications: Automotive, ESD Protection; Capacitance: 10000 pF; componentlink1description: Datasheet; componentlink1url: https://api.kemet.com/component-edge/download/datasheet/C0402C103K5RECAUTO.pdf; componentlink2description: DigiKey Link; componentlink2url: https://www.digikey.com/en/products/detail/kemet/C0402C103K5RECAUTO/8646477; Device Package: 0402 (1005 Metric); lastupdated: 19/09/2022 12:56:43; Lifecycle Status: Active; Minimum Order: 1; Mounting Type: Surface Mount, MLCC; Operating Temperature: -55°C ~ 125°C; Package / Case: 0402 (1005 Metric); packaging: TapeAndReel; partid: 38916; Part Status: Active; price: 0.01; Ratings: AEC-Q200; series: ESD SMD Auto X7R; Size / Dimension: 0.039" L x 0.020" W (1.00mm x 0.50mm); Supplier 1: DigiKey; Supplier Part Number 1: 399-C0402C103K5RECAUTOCT-ND; Temperature Coefficient: X7R; Thickness (Max): 0.022" (0.55mm); Tolerance: ±10%; Voltage - Rated: 50V
FB6 = CMP-0686-00246-4: as FB1 on sheet FTDI_USB; Max Current Rating: 500mA; Core Material: Ferrite; Lead Free: Lead Free; Series: BLM15AX_SN; Number of Pins: 2; Package Quantity: 1; Length: 1mm; Height: 0.5mm; Width: 0.5mm; Packaging: Tape and Reel; RoHS Compliant: Yes; Test Frequency: 100MHz; Case Code (Imperial): 0402; Depth: 0.5mm; Case/Package: 0402; Min Operating Temperature: -55°C; Max Operating Temperature: 125°C; Max DC Current: 500mA; Current Rating: 500mA; REACH SVHC: No SVHC; Termination: SMD/SMT; Tolerance: 25%; Case Code (Metric): 1005; Number of Lines: 1; DC Resistance-Max: 340mR
IC2 = SP3003-02JTG: as IC1 on sheet FTDI_USB; Datasheet Link: https://datasheet.datasheetarchive.com/originals/distributors/Datasheets-DGA26/1840396.pdf; Height: 1.1mm; Manufacturer_Part_Number: SP3003-02JTG; Mouser Part Number: 576-SP3003-02JTG; Mouser Price/Stock: https://www.mouser.co.uk/ProductDetail/Littelfuse/SP3003-02JTG?qs=je4hkJKt%2FJ1VE%2FhJSW73jg%3D%3D; Arrow Part Number: SP3003-02JTG; Arrow Price/Stock: https://www.arrow.com/en/products/sp3003-02jtg/littelfuse?region=nac
J4 = 10118194-0011LF: USB - micro B USB 2.0 Receptacle Connector 5 Position Surface Mount, Right Angle; Through Hole; Manufacturer: Amphenol ICC (FCI); Manufacturer Standard Lead Time: 9 Week; Product Status: Active; Number of Contacts: 5; Specifications: USB 2.0; Number of Ports: 1; Current Rating (Amps): 1.8A per Contact; Voltage - Rated: 100VAC; Mating Cycles: 10000; Shielding: Shielded; Material Flammability Rating: UL94 V-0; Digi-Key Part Number: 10118194-0011LF-ND; Manufacturer Product Number: 10118194-0011LF; Category: Connectors, Interconnects USB, DVI, HDMI Connectors USB, DVI, HDMI Connector Assemblies; Series: -; Package: Tape & Reel (TR); Connector Type: USB - Micro B; ComponentLink1Description: Digi-Key Link; ComponentLink1URL: https://www.digikey.com/en/products/detail/amphenol-cs-fci/10118194-0011LF/681; ComponentLink2Description: Datasheet; ComponentLink2URL: https://www.amphenol-cs.com/media/wysiwyg/files/drawing/10118194.pdf; Supplier 1: Digi-Key; Supplier Part Number 1: 10118194-0011LF-ND; Gender: Receptacle; Mounting Type: Surface Mount, Right Angle; Through Hole; Mounting Feature: Horizontal; Termination: Solder; Features: Solder Retention; Ingress Protection: -; Operating Temperature: -30°C ~ 80°C; Contact Finish: Gold; Shell/Shielding Material: Steel, Stainless; Insulation Color: Black; Base Product Number: 10118194
R11 = RC0402FR-0744K2L: RES 44.2K OHM 1% 1/16W 0402; Manufacturer: Yageo; Power (Watts): 0.063W, 1/16W; Temperature Coefficient: ±100ppm/°C; Part Number: RC0402FR-0744K2L; Value: 44.2 kOhms; ComponentLink1Description: Datasheet; ComponentLink1URL: https://www.yageo.com/upload/media/product/productsearch/datasheet/rchip/PYu-RC_Group_51_RoHS_L_10.pdf; ComponentLink2Description: DigiKey Link; ComponentLink2URL: https://www.digikey.com/en/products/detail/yageo/RC0402FR-0744K2L/5281023; Composition: Thick Film; Device Package: 0402 (1005 Metric); Features: Moisture Resistant; Height - Seated (Max): 0.016" (0.40mm); LastUpdated: 1/2/2023 08:21:51 PM; Lifecycle Status: Active; Minimum Order: 1; Number of Terminations: 2; Operating Temperature: -55°C ~ 155°C; Package / Case: 0402 (1005 Metric); Packaging: CutTape; PartId: 2628; Part Status: Active; Price: 0.01; Resistance: 44.2 kOhms; Series: RC_L; Size / Dimension: 0.039" L x 0.020" W (1.00mm x 0.50mm); Supplier 1: DigiKey; Supplier Part Number 1: YAG3163CT-ND; Supplier Device Package: 0402; Tolerance: ±1%
R12 = RC0402JR-0720KL: RES 20K OHM 5% 1/16W 0402; Manufacturer: Yageo; Power (Watts): 0.063W, 1/16W; Temperature Coefficient: ±100ppm/°C; Part Number: RC0402JR-0720KL; Value: 20 kOhms; ComponentLink1Description: Datasheet; ComponentLink1URL: https://www.yageo.com/upload/media/product/productsearch/datasheet/rchip/PYu-RC_Group_51_RoHS_L_10.pdf; ComponentLink2Description: DigiKey Link; ComponentLink2URL: https://www.digikey.com/en/products/detail/yageo/RC0402JR-0720KL/2827648; Composition: Thick Film; Device Package: 0402 (1005 Metric); Features: Moisture Resistant; Height - Seated (Max): 0.016" (0.40mm); LastUpdated: 1/2/2023 08:21:42 PM; Lifecycle Status: Active; Minimum Order: 1; Number of Terminations: 2; Operating Temperature: -55°C ~ 155°C; Package / Case: 0402 (1005 Metric); Packaging: CutTape; PartId: 4787; Part Status: Active; Price: 0.01; Resistance: 20 kOhms; Series: RC_L; Size / Dimension: 0.039" L x 0.020" W (1.00mm x 0.50mm); Supplier 1: DigiKey; Supplier Part Number 1: 311-20KJRCT-ND; Supplier Device Package: 0402; Tolerance: ±5%
R16 = RC0402FR-078K06L: RES 8.06K OHM 1% 1/16W 0402; Manufacturer: Yageo; Power (Watts): 0.063W, 1/16W; Temperature Coefficient: ±100ppm/°C; Part Number: RC0402FR-078K06L; Value: 8.06 kOhms; ComponentLink1Description: Datasheet; ComponentLink1URL: https://www.yageo.com/upload/media/product/productsearch/datasheet/rchip/PYu-RC_Group_51_RoHS_L_10.pdf; ComponentLink2Description: DigiKey Link; ComponentLink2URL: https://www.digikey.com/en/products/detail/yageo/RC0402FR-078K06L/726661; Composition: Thick Film; Device Package: 0402 (1005 Metric); Features: Moisture Resistant; Height - Seated (Max): 0.016" (0.40mm); LastUpdated: 1/2/2023 08:21:51 PM; Lifecycle Status: Active; Minimum Order: 1; Number of Terminations: 2; Operating Temperature: -55°C ~ 155°C; Package / Case: 0402 (1005 Metric); Packaging: CutTape; PartId: 2529; Part Status: Active; Price: 0.01; Resistance: 8.06 kOhms; Series: RC_L; Size / Dimension: 0.039" L x 0.020" W (1.00mm x 0.50mm); Supplier 1: DigiKey; Supplier Part Number 1: 311-8.06KLRCT-ND; Supplier Device Package: 0402; Tolerance: ±1%
R19 = RC0402JR-070RL: RES 0 OHM JUMPER 1/16W 0402; Manufacturer: Yageo; Power (Watts): 0.063W, 1/16W; Part Number: RC0402JR-070RL; Value: 0 Ohms; ComponentLink1Description: Datasheet; ComponentLink1URL: https://www.yageo.com/upload/media/product/productsearch/datasheet/rchip/PYu-RC_Group_51_RoHS_L_10.pdf; ComponentLink2Description: DigiKey Link; ComponentLink2URL: https://www.digikey.com/en/products/detail/yageo/RC0402JR-070RL/726406; Composition: Thick Film; Device Package: 0402 (1005 Metric); Features: Moisture Resistant; Height - Seated (Max): 0.016" (0.40mm); LastUpdated: 1/2/2023 08:20:46 PM; Lifecycle Status: Active; Minimum Order: 1; Number of Terminations: 2; Operating Temperature: -55°C ~ 155°C; Package / Case: 0402 (1005 Metric); Packaging: CutTape; PartId: 17588; Part Status: Active; Price: 0.01; Resistance: 0 Ohms; Series: RC_L; Size / Dimension: 0.039" L x 0.020" W (1.00mm x 0.50mm); Supplier 1: DigiKey; Supplier Part Number 1: 311-0.0JRCT-ND; Supplier Device Package: 0402; Tolerance: Jumper
U6 = CMP-07121-000001-1: IC PWR SWITCH P-CHAN 1:1 6UDFN; Manufacturer: ON Semiconductor; Max Power Dissipation: 830mW; Standoff Height: 0mm; Nominal Supply Current: 90uA; Max Supply Voltage: 5.5V; Number Of Outputs: 1; Max Junction Temp: +125°C; Output Current: 0.5-2.1A; Min Supply Voltage: 2.5V; ComponentLink2Description: Datasheet; Device Class L3: unset; Device Class L1: Integrated Circuits (ICs); ComponentLink2URL: https://www.onsemi.com/pub/Collateral/NCP380-D.PDF; Digikey Description: IC PWR SWITCH P-CHAN 1:1 6UDFN; Package: 517AB; Temperature: -40°C to +125°C; RoHS: TRUE; Footprint Url: https://www.onsemi.com/pub/Collateral/517AB.PDF; Automotive: No; Manufacturer Part Number: NCP380HMUAJAATBG; Octopart: https://octopart.com/ncp380hmuajaatbg-on+semiconductor-19977070; Lead Free: Yes; Ambient Temperature Range High: +85°C; Mouser Description: Power Switch ICs - Power Distribution OVER CURRENT PROTECTION; Category: IC; Temperature Range High: +125°C; Device Class L2: Power Management ICs; Ambient Temperature Range Low: -40°C; Height: 0.55mm; Temperature Range Low: -40°C
Y3 = ASVTX-11-A-26.000MHZ-T: XTAL OSC VCTCXO 26.0000MHZ SNWV; Manufacturer: Abracon LLC; Base Resonator: Crystal; Current - Supply (Max): 2mA; Frequency Stability: ±2.5ppm; Output: Clipped Sine Wave; Voltage - Supply: 3V; Part Number: ASVTX-11-A-26.000MHZ-T; ComponentLink1Description: Datasheet; ComponentLink1URL: https://abracon.com/Oscillators/ASTX11_ASVTX11.pdf; ComponentLink2Description: DigiKey Link; ComponentLink2URL: http://digikey.com/product-detail/en/abracon-llc/ASVTX-11-A-26.000MHZ-T/535-9619-1-ND/1237086; Frequency: 26MHz; Height - Seated (Max): 0.039" (1.00mm); LastUpdated: 19/09/2022 13:51:47; Lifecycle Status: Active; Minimum Order: 1; Mounting Type: Surface Mount; Operating Temperature: -30°C ~ 75°C; Package / Case: 6-SMD, No Lead; Packaging: TapeAndReel; PartId: 249; Part Status: Active; Price: 2.37; Series: ASVTX-11; Size / Dimension: 0.126" L x 0.098" W (3.20mm x 2.50mm); Supplier 1: DigiKey; Supplier Part Number 1: 535-9619-1-ND; Type: VCTCXO; Value: 26MHz